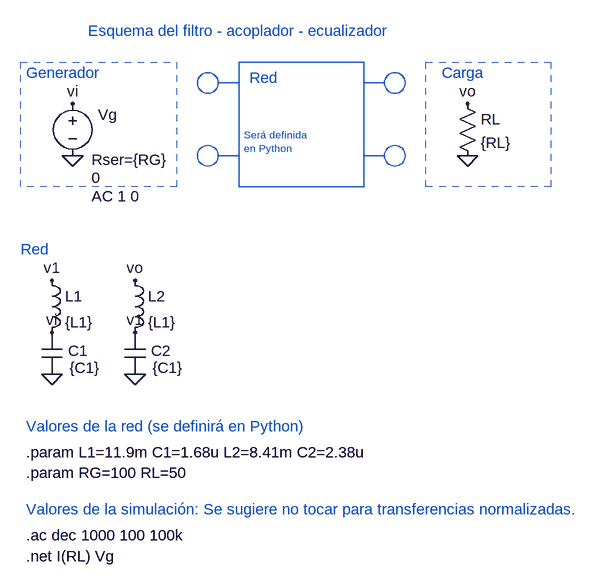
[diagram p0: schematic spar.asc]
spar.asc, the LTspice schematic file:
Version 4
SHEET 1 916 680
FLAG 32 -192 0
FLAG 0 144 0
FLAG 640 -192 0
FLAG 32 -272 vi
FLAG 640 -272 vo
FLAG 0 80 vi
FLAG 0 0 v1
FLAG 128 144 0
FLAG 128 80 v1
FLAG 128 0 vo
SYMBOL voltage 32 -288 R0
WINDOW 3 29 130 Left 2
WINDOW 123 29 158 Left 2
WINDOW 39 29 102 Left 2
WINDOW 0 39 33 Left 2
SYMATTR Value 0
SYMATTR Value2 AC 1 0
SYMATTR SpiceLine Rser={RG}
SYMATTR InstName Vg
SYMBOL res 624 -288 R0
SYMATTR InstName RL
SYMATTR Value {RL}
SYMBOL ind -16 -16 R0
SYMATTR InstName L1
SYMATTR Value {L1}
SYMBOL cap -16 80 R0
WINDOW 0 41 28 Left 2
WINDOW 3 43 54 Left 2
SYMATTR InstName C1
SYMATTR Value {C1}
SYMBOL ind 112 -16 R0
SYMATTR InstName L2
SYMATTR Value {L1}
SYMBOL cap 112 80 R0
WINDOW 0 41 28 Left 2
WINDOW 3 43 54 Left 2
SYMATTR InstName C2
SYMATTR Value {C1}
TEXT -40 424 Left 2 !.net I(RL) Vg
TEXT -40 392 Left 2 !.ac dec 1000 100 100k
TEXT 304 -312 Left 2 ;Red
TEXT -40 -320 Left 2 ;Generador
TEXT 600 -320 Left 2 ;Carga
TEXT 296 -224 Left 1 ;Será definida \nen Python
TEXT -40 224 Left 2 ;Valores de la red (se definirá en Python)
TEXT -40 296 Left 2 !.param RG=100 RL=50
TEXT -40 264 Left 2 !.param L1=11.9m C1=1.68u L2=8.41m C2=2.38u
TEXT 56 -384 Left 2 ;Esquema del filtro - acoplador - ecualizador
TEXT -40 352 Left 2 ;Valores de la simulación: Se sugiere no tocar para transferencias normalizadas.
TEXT -48 -48 Left 2 ;Red
LINE Normal 288 -304 256 -304
LINE Normal 288 -192 256 -192
LINE Normal 480 -192 512 -192
LINE Normal 480 -304 512 -304
RECTANGLE Normal 480 -144 288 -336
RECTANGLE Normal 768 -144 576 -336 2
RECTANGLE Normal 192 -144 -48 -336 2
CIRCLE Normal 256 -288 224 -320
CIRCLE Normal 256 -176 224 -208
CIRCLE Normal 512 -208 544 -176
CIRCLE Normal 512 -320 544 -288

The netlist it stands for:
* spar.asc
Vg vi 0 0 AC 1 0 Rser={RG}
RL vo 0 {RL}
L1 v1 vi {L1}
C1 vi 0 {C1}
L2 vo v1 {L1}
C2 v1 0 {C1}
.net I(RL) Vg
.ac dec 1000 100 100k
* Red
* Generador
* Carga
* Será definida
* en Python
* Valores de la red (se definirá en Python)
.param RG=100 RL=50
.param L1=11.9m C1=1.68u L2=8.41m C2=2.38u
* Esquema del filtro - acoplador - ecualizador
* Valores de la simulación: Se sugiere no tocar para transferencias normalizadas.
* Red
.backanno
.end

* Results of the author's LTspice run, read from the files saved beside the schematic
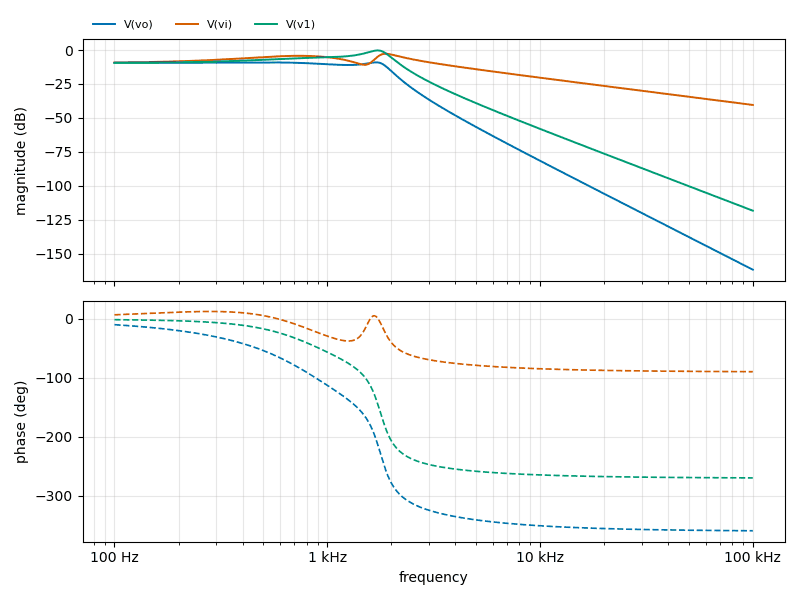
[diagram p1: AC Analysis of spar.asc, plotted from the saved traces]
* AC Analysis, 1 run:
*   V(vo): -9.51 dB at 100 Hz, -161.91 dB at 100 kHz, peak -9.05 dB at 1.698 kHz, 3 dB below the peak at 1.888 kHz
*   V(vi): -9.20 dB at 100 Hz, -40.47 dB at 100 kHz, peak -2.74 dB at 1.879 kHz, 3 dB below the peak at 1.699 kHz and 2.329 kHz
*   V(v1): -9.41 dB at 100 Hz, -118.41 dB at 100 kHz, peak -0.27 dB at 1.726 kHz, 3 dB below the peak at 1.416 kHz and 1.917 kHz